# Altium schematic sheet PortSplitters.SchDoc: Port splitter Weather Station
size A; Organization: Altium Limited; Address1: L3, 12a Rodborough Rd; Address2: Frenchs Forest; Address3: NSW; Address4: Australia 2086; DocumentNumber: 2; SheetNumber: 2; SheetTotal: 2
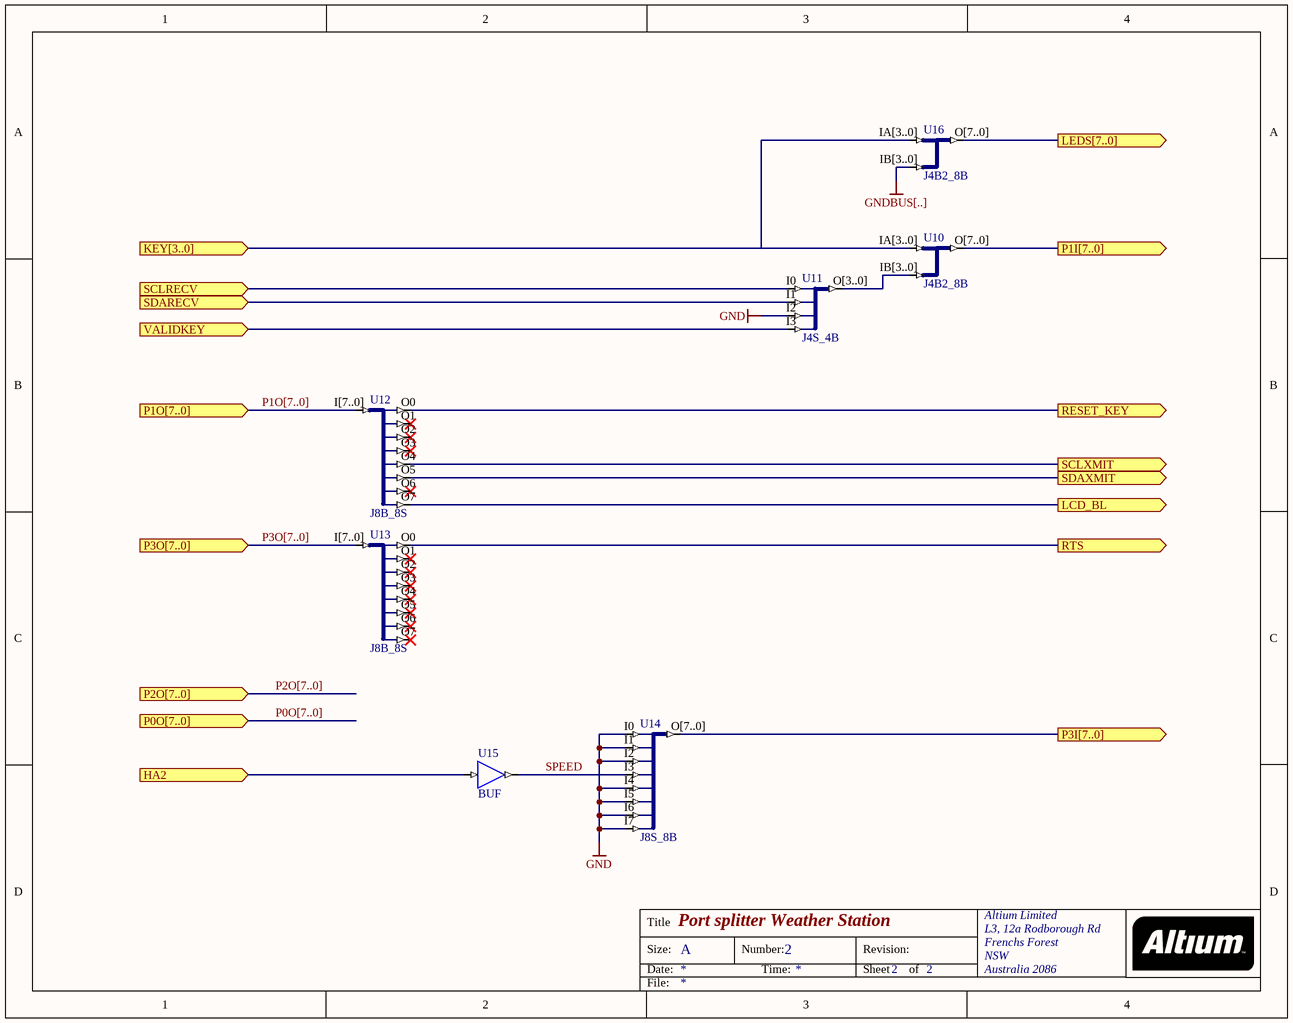
[diagram p0: PortSplitters.SchDoc]

## Parts
U10  J4B2_8B
U11  J4S_4B
U12  J8B_8S
U13  J8B_8S
U14  J8S_8B
U15  BUF
U16  J4B2_8B

## Ports
HA2 (in), KEY[3..0] (in), LCD_BL (out), LEDS[7..0] (out), P0O[7..0] (in), P1I[7..0] (out), P1O[7..0] (in), P2O[7..0] (in), P3I[7..0] (out), P3O[7..0] (in), RESET_KEY (out), RTS (out), SCLRECV (in), SCLXMIT (out), SDARECV (in), SDAXMIT (out), VALIDKEY (in)

## Nets
GND: U11.I2 U14.I0 U14.I1 U14.I2 U14.I4 U14.I5 U14.I6 U14.I7
GNDBUS[..]: U16.IB[3..0]
HA2: U15.I ; port HA2
KEY[3..0]: U10.IA[3..0] U16.IA[3..0] ; port KEY[3..0]
LCD_BL: U12.O7 ; port LCD_BL
LEDS[7..0]: U16.O[7..0] ; port LEDS[7..0]
P1I[7..0]: U10.O[7..0] ; port P1I[7..0]
P1O[7..0]: U12.I[7..0] ; port P1O[7..0]
P3I[7..0]: U14.O[7..0] ; port P3I[7..0]
P3O[7..0]: U13.I[7..0] ; port P3O[7..0]
RESET_KEY: U12.O0 ; port RESET_KEY
RTS: U13.O0 ; port RTS
SCLRECV: U11.I0 ; port SCLRECV
SCLXMIT: U12.O4 ; port SCLXMIT
SDARECV: U11.I1 ; port SDARECV
SDAXMIT: U12.O5 ; port SDAXMIT
SPEED: U14.I3 U15.O
VALIDKEY: U11.I3 ; port VALIDKEY
NetU10_IB[3..0]: U10.IB[3..0] U11.O[3..0]

Not connected (* = marked no-connect by the designer): U12 O1* O2* O3* O6*; U13 O1* O2* O3* O4* O5* O6* O7*

## Buses and harness runs
bus P0O[7..0] = port P0O[7..0]
bus P1O[7..0] = port P1O[7..0]
bus P2O[7..0] = port P2O[7..0]
bus P3O[7..0] = port P3O[7..0]

## Notes on the sheet
- Title
- Size:
- Date:
- A
- Number:
- Time:
- Revision:
- Sheet
- of
- File:

## Library data of the parts
U10 = J4B2_8B: 2 x 4-Bit input bus to 1 x 8-bit output bus; ArchiveName: GENERIC; Published: 18-Dec-2003; Publisher: Altium Limited; Core Revision: 1.00.00
U11 = J4S_4B: 4 Single pin inputs to single 4-Bit output bus; ArchiveName: GENERIC; Published: 18-Dec-2003; Publisher: Altium Limited; Core Revision: 1.00.00
U12 U13 = J8B_8S: 8-Bit input bus to 8 single pin outputs; ArchiveName: GENERIC; Published: 18-Dec-2003; Publisher: Altium Limited; Core Revision: 1.00.00
U14 = J8S_8B: 8 Single pin inputs to single 8-Bit output bus; ArchiveName: GENERIC; Published: 18-Dec-2003; Publisher: Altium Limited; Core Revision: 1.00.00
U15 = BUF: 1-bit General Purpose (Non-inverting) Buffer; ArchiveName: GENERIC; Published: 18-Dec-2003; Publisher: Altium Limited; Xilinx Equivalent: BUF; Core Revision: 1.00.00
U16 = J4B2_8B: 2 x 4-Bit input bus to 1 x 8-bit output bus; ArchiveName: GENERIC; VHDLIB_SIM: GENERIC_LIB; Published: 29-Jan-2004; Publisher: Altium Limited; Core Revision: 1.00.00